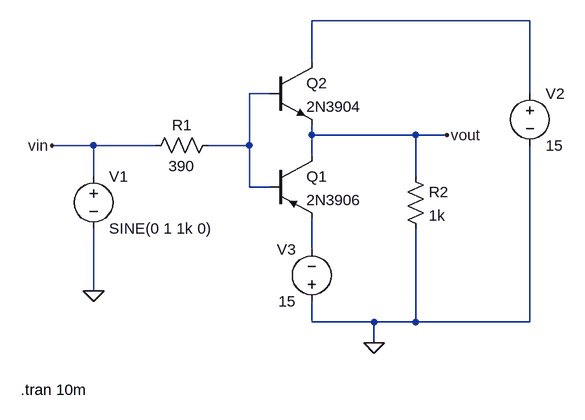
[diagram p0: schematic pushpull.asc]
pushpull.asc, the LTspice schematic file:
Version 4
SHEET 1 880 680
WIRE 544 -32 208 -32
WIRE 208 32 208 -32
WIRE 144 80 112 80
WIRE 544 80 544 -32
WIRE 208 144 208 128
WIRE 368 144 208 144
WIRE 416 144 368 144
WIRE -128 160 -192 160
WIRE -32 160 -128 160
WIRE 112 160 112 80
WIRE 112 160 48 160
WIRE 208 176 208 144
WIRE -128 208 -128 160
WIRE 368 208 368 144
WIRE 112 224 112 160
WIRE 144 224 112 224
WIRE 208 320 208 272
WIRE -128 384 -128 288
WIRE 208 432 208 400
WIRE 304 432 208 432
WIRE 368 432 368 288
WIRE 368 432 304 432
WIRE 544 432 544 160
WIRE 544 432 368 432
WIRE 304 464 304 432
FLAG -192 160 vin
FLAG -128 384 0
FLAG 304 464 0
FLAG 416 144 vout
SYMBOL pnp 144 176 R0
SYMATTR InstName Q1
SYMATTR Value 2N3906
SYMBOL npn 144 32 R0
SYMATTR InstName Q2
SYMATTR Value 2N3904
SYMBOL res 64 144 R90
WINDOW 0 0 56 VBottom 2
WINDOW 3 32 56 VTop 2
SYMATTR InstName R1
SYMATTR Value 390
SYMBOL voltage -128 192 R0
WINDOW 123 0 0 Left 0
WINDOW 39 0 0 Left 0
SYMATTR InstName V1
SYMATTR Value SINE(0 1 1k 0)
SYMBOL voltage 544 64 R0
WINDOW 123 0 0 Left 0
WINDOW 39 0 0 Left 0
SYMATTR InstName V2
SYMATTR Value 15
SYMBOL voltage 208 416 R180
WINDOW 0 24 96 Left 2
WINDOW 3 24 16 Left 2
WINDOW 123 0 0 Left 0
WINDOW 39 0 0 Left 0
SYMATTR InstName V3
SYMATTR Value 15
SYMBOL res 352 192 R0
SYMATTR InstName R2
SYMATTR Value 1k
TEXT -240 536 Left 2 !.tran 10m

The netlist it stands for:
* pushpull.asc
Q1 vout N002 N003 0 2N3906
Q2 N001 N002 vout 0 2N3904
R1 N002 vin 390
V1 vin 0 SINE(0 1 1k 0)
V2 N001 0 15
V3 0 N003 15
R2 vout 0 1k
.model NPN NPN
.model PNP PNP
.lib standard.bjt
.tran 10m
.backanno
.end

* Results of the author's LTspice run, read from the files saved beside the schematic
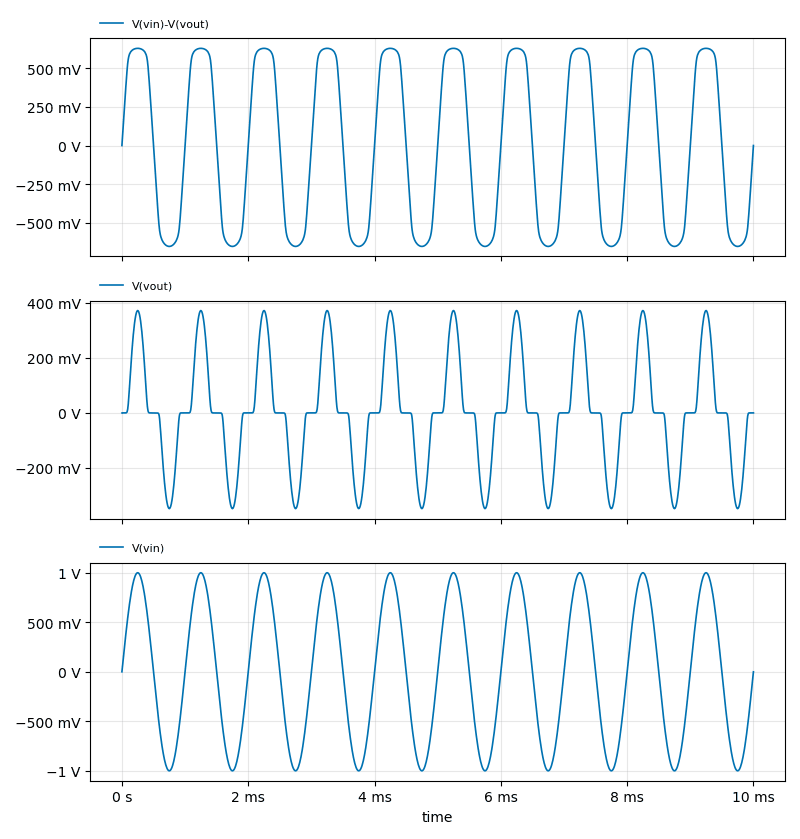
[diagram p1: Transient Analysis of pushpull.asc, plotted from the saved traces]
* Transient Analysis, 1 run:
*   V(vin)-V(vout): min -651.9 mV, max 627.6 mV, average -4.618 mV, rms 527.7 mV, last -78.37 µV
*   V(vout): min -348.1 mV, max 372.4 mV, average 4.607 mV, rms 201.8 mV, last 78.37 µV
*   V(vin): min -1 V, max 1 V, average -11.14 µV, rms 707.3 mV, last 0 V